# Altium schematic sheet 08. MT7688AN DDR2.SchDoc
size A2; DocumentNumber: 8; SheetNumber: 8; SheetTotal: 12
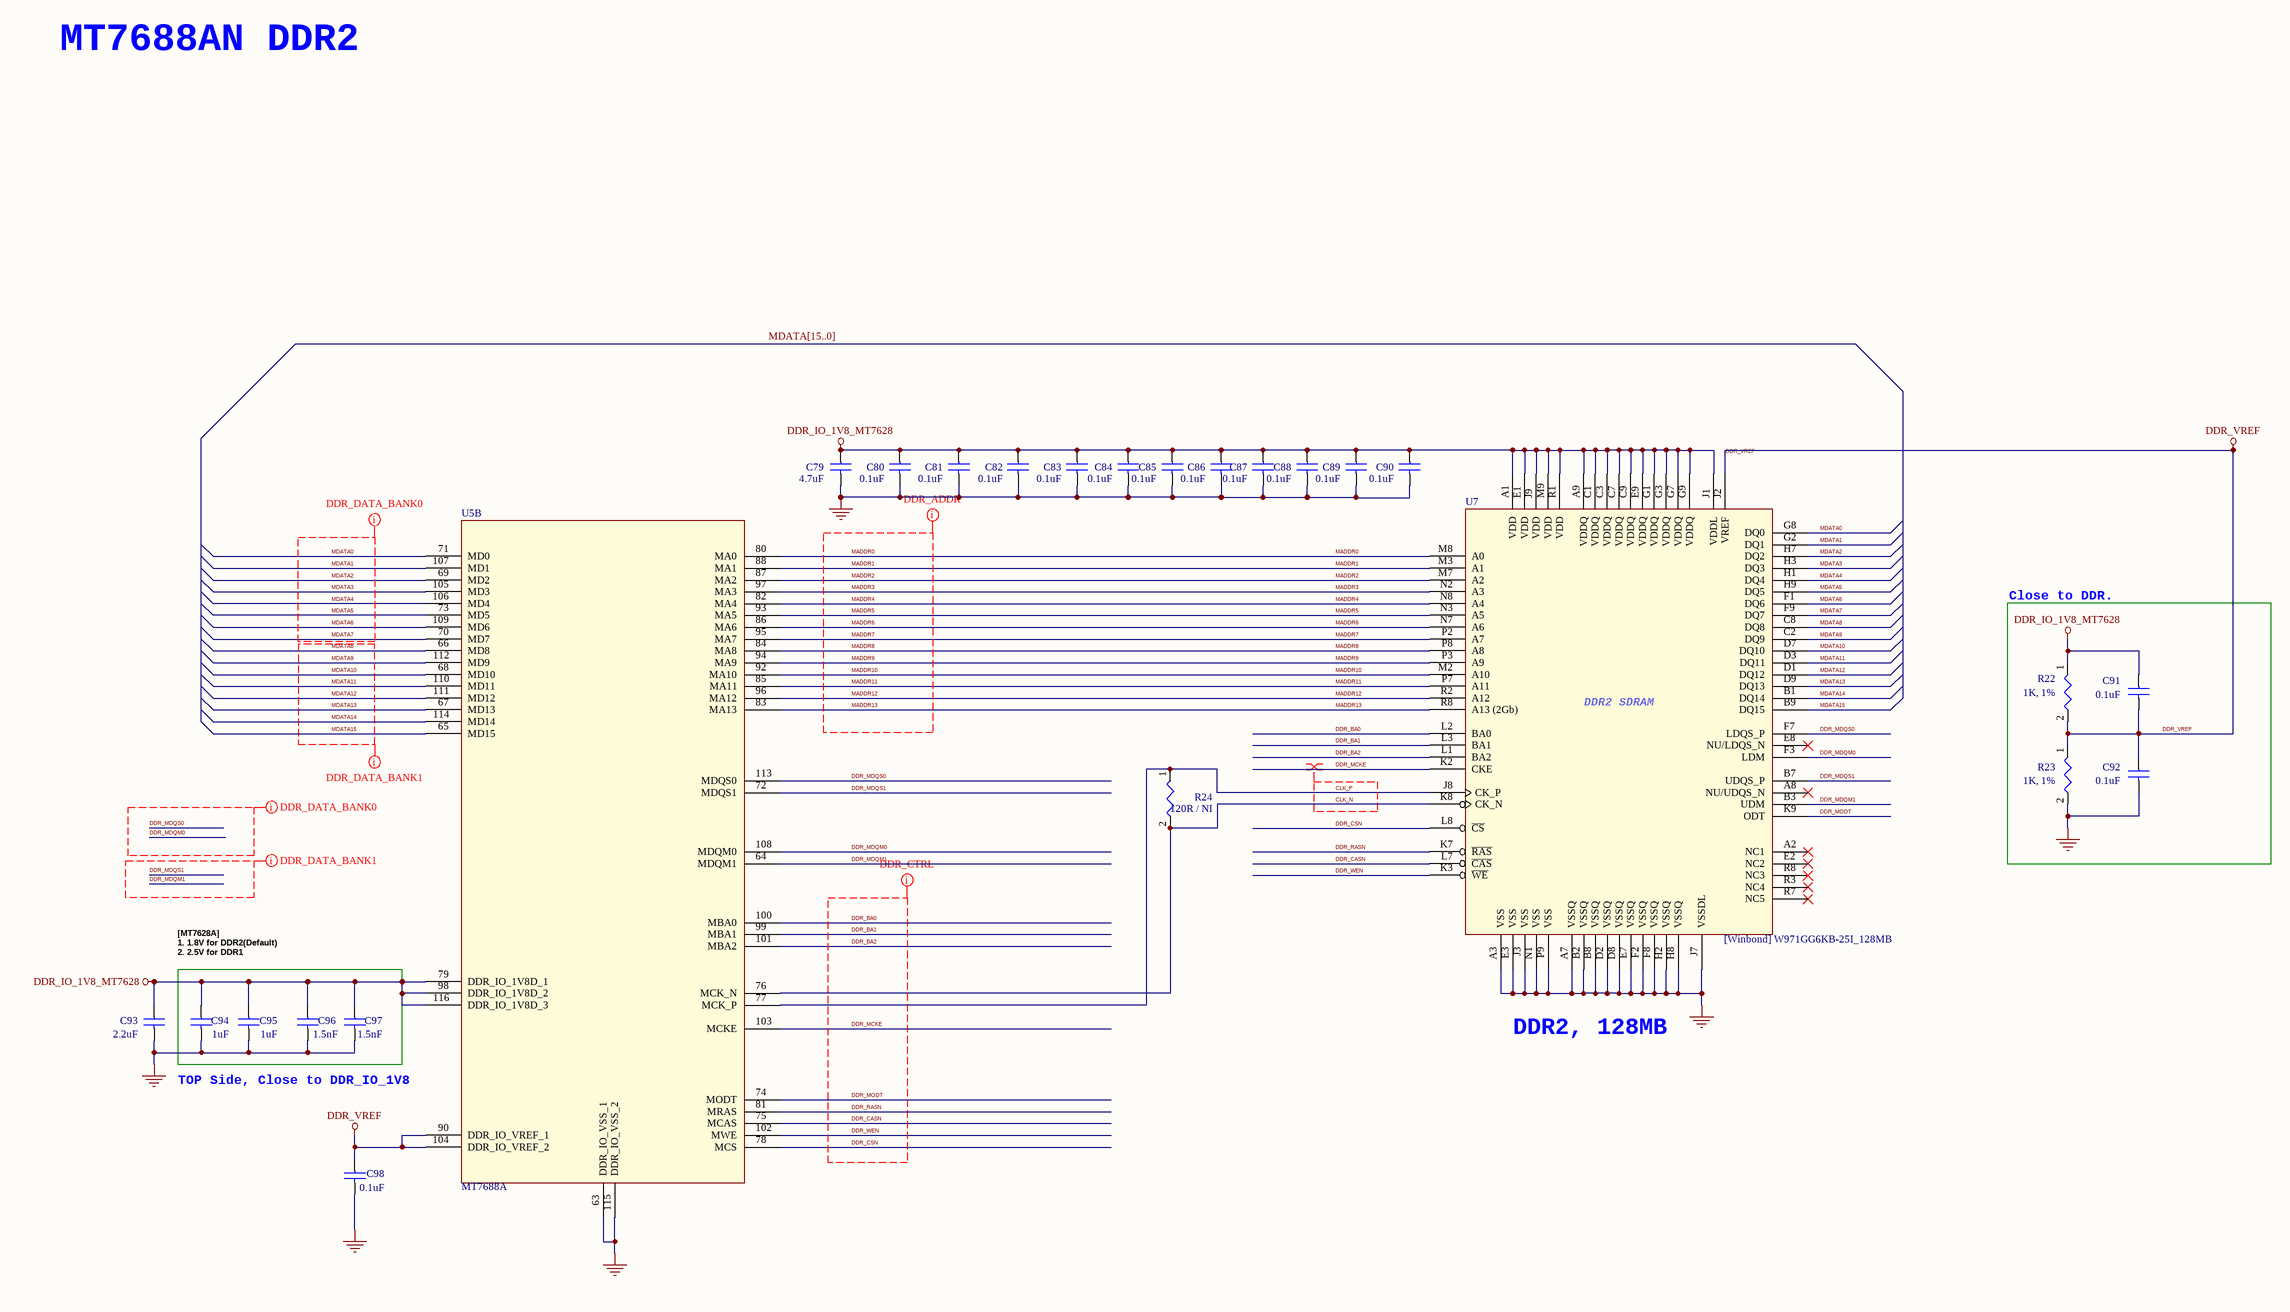
[diagram p0: 08. MT7688AN DDR2.SchDoc]

## Parts
C79  4.7uF  [CAPC1608X90X35NL10T15]
C80  0.1uF  [CAPC1005X60X30NL05T10]
C81  0.1uF  [CAPC1005X60X30NL05T10]
C82  0.1uF  [CAPC1005X60X30NL05T10]
C83  0.1uF  [CAPC1005X60X30NL05T10]
C84  0.1uF  [CAPC1005X60X30NL05T10]
C85  0.1uF  [CAPC1005X60X30NL05T10]
C86  0.1uF  [CAPC1005X60X30NL05T10]
C87  0.1uF  [CAPC1005X60X30NL05T10]
C88  0.1uF  [CAPC1005X60X30NL05T10]
C89  0.1uF  [CAPC1005X60X30NL05T10]
C90  0.1uF  [CAPC1005X60X30NL05T10]
C91  0.1uF  [CAPC1005X60X30NL05T10]
C92  0.1uF  [CAPC1005X60X30NL05T10]
C93  2.2uF  [CAPC1608X90X35NL10T15]
C94  1uF  [CAPC1608X90X35NL10T15]
C95  1uF  [CAPC1608X90X35NL10T15]
C96  1.5nF  [CAPC1005X60X30NL05T10]
C97  1.5nF  [CAPC1005X60X30NL05T10]
C98  0.1uF  [CAPC1005X60X30NL05T10]
R22  1K, 1%  [RESC1005X35X25NL10T10]
R23  1K, 1%  [RESC1005X35X25NL10T10]
R24  120R / NI  [RLC 0201 M35]
U5  MT7688A  [MT7628AN$2F$DRQFN156$2F$SMD$2F$P0.5$2F$12X12]  (part B of 6)
U7  [Winbond] W971GG6KB-25I_128MB  [BGA84C80P9X15X12X8]

## Blocks framed on the sheet
Close to DDR.: C91 C92 R22 R23

## Nets
DDR_IO_1V8_MT7628: C79.1 C80.1 C81.1 C82.1 C83.1 C84.1 C85.1 C86.1 C87.1 C88.1 C89.1 C90.1 C91.1 C93.1 C94.1 C95.1 C96.1 C97.1 R22.1 U5.79(DDR_IO_1V8D_1) U5.98(DDR_IO_1V8D_2) U5.116(DDR_IO_1V8D_3) U7.A1(VDD) U7.A9(VDDQ) U7.C1(VDDQ) U7.C3(VDDQ) U7.C7(VDDQ) U7.C9(VDDQ) U7.E1(VDD) U7.E9(VDDQ) U7.G1(VDDQ) U7.G3(VDDQ) U7.G7(VDDQ) U7.G9(VDDQ) U7.J1(VDDL) U7.J9(VDD) U7.M9(VDD) U7.R1(VDD)
DDR_VREF: C91.2 C92.1 C98.1 R22.2 R23.1 U5.90(DDR_IO_VREF_1) U5.104(DDR_IO_VREF_2) U7.J2(VREF)
GND: C79.2 C80.2 C81.2 C82.2 C83.2 C84.2 C85.2 C86.2 C87.2 C88.2 C89.2 C90.2 C92.2 C93.2 C94.2 C95.2 C96.2 C97.2 C98.2 R23.2 U5.63(DDR_IO_VSS_1) U5.115(DDR_IO_VSS_2) U7.A3(VSS) U7.A7(VSSQ) U7.B2(VSSQ) U7.B8(VSSQ) U7.D2(VSSQ) U7.D8(VSSQ) U7.E3(VSS) U7.E7(VSSQ) U7.F2(VSSQ) U7.F8(VSSQ) U7.H2(VSSQ) U7.H8(VSSQ) U7.J3(VSS) U7.J7(VSSDL) U7.N1(VSS) U7.P9(VSS)
CLK_N: R24.2 U5.76(MCK_N) U7.K8(CK_N)
CLK_P: R24.1 U5.77(MCK_P) U7.J8(CK_P)
DDR_BA0: U5.100(MBA0) U7.L2(BA0)
DDR_BA1: U5.99(MBA1) U7.L3(BA1)
DDR_BA2: U5.101(MBA2) U7.L1(BA2)
DDR_CASN: U5.75(MCAS) U7.L7(~{CAS})
DDR_CSN: U5.78(MCS) U7.L8(~{CS})
DDR_MCKE: U5.103(MCKE) U7.K2(CKE)
DDR_MDQM0: U5.108(MDQM0) U7.F3(LDM)
DDR_MDQM1: U5.64(MDQM1) U7.B3(UDM)
DDR_MDQS0: U5.113(MDQS0) U7.F7(LDQS_P)
DDR_MDQS1: U5.72(MDQS1) U7.B7(UDQS_P)
DDR_MODT: U5.74(MODT) U7.K9(ODT)
DDR_RASN: U5.81(MRAS) U7.K7(~{RAS})
DDR_WEN: U5.102(MWE) U7.K3(~{WE})
MADDR0: U5.80(MA0) U7.M8(A0)
MADDR1: U5.88(MA1) U7.M3(A1)
MADDR2: U5.87(MA2) U7.M7(A2)
MADDR3: U5.97(MA3) U7.N2(A3)
MADDR4: U5.82(MA4) U7.N8(A4)
MADDR5: U5.93(MA5) U7.N3(A5)
MADDR6: U5.86(MA6) U7.N7(A6)
MADDR7: U5.95(MA7) U7.P2(A7)
MADDR8: U5.84(MA8) U7.P8(A8)
MADDR9: U5.94(MA9) U7.P3(A9)
MADDR10: U5.92(MA10) U7.M2(A10)
MADDR11: U5.85(MA11) U7.P7(A11)
MADDR12: U5.96(MA12) U7.R2(A12)
MADDR13: U5.83(MA13) U7.R8(A13_(2Gb))
MDATA0: U5.71(MD0) U7.G8(DQ0)
MDATA1: U5.107(MD1) U7.G2(DQ1)
MDATA2: U5.69(MD2) U7.H7(DQ2)
MDATA3: U5.105(MD3) U7.H3(DQ3)
MDATA4: U5.106(MD4) U7.H1(DQ4)
MDATA5: U5.73(MD5) U7.H9(DQ5)
MDATA6: U5.109(MD6) U7.F1(DQ6)
MDATA7: U5.70(MD7) U7.F9(DQ7)
MDATA8: U5.66(MD8) U7.C8(DQ8)
MDATA9: U5.112(MD9) U7.C2(DQ9)
MDATA10: U5.68(MD10) U7.D7(DQ10)
MDATA11: U5.110(MD11) U7.D3(DQ11)
MDATA12: U5.111(MD12) U7.D1(DQ12)
MDATA13: U5.67(MD13) U7.D9(DQ13)
MDATA14: U5.114(MD14) U7.B1(DQ14)
MDATA15: U5.65(MD15) U7.B9(DQ15)

Not connected (* = marked no-connect by the designer): U7 A2(NC1)* A8(NU/UDQS_N)* E2(NC2)* E8(NU/LDQS_N)* R3(NC4)* R7(NC5)*

## Buses and harness runs
bus MDATA[15..0]

## Layout directives
net class DDR_DATA_BANK1; rule Matched Net Lengths [Tolerance = 20mil]: DDR_MDQM1, DDR_MDQS1, MDATA8, MDATA9, MDATA10, MDATA11, MDATA12, MDATA13, MDATA14, MDATA15
net class DDR_DATA_BANK0; rule Matched Net Lengths [Tolerance = 20mil]: DDR_MDQM0, DDR_MDQS0, MDATA0, MDATA1, MDATA2, MDATA3, MDATA4, MDATA5, MDATA6, MDATA7
net class DDR2_CLK; rule Matched Net Lengths [Tolerance = 20mil]: CLK_N, CLK_P
rule Matched Net Lengths [Tolerance = 50mil]; net class DDR2_ADDR_CTRL: DDR_BA0, DDR_BA1, DDR_BA2, DDR_CASN, DDR_CSN, DDR_MCKE, DDR_MODT, DDR_RASN, DDR_WEN, MADDR0, MADDR1, MADDR2, MADDR3, MADDR4, MADDR5, MADDR6, MADDR7, MADDR8, MADDR9, MADDR10, MADDR11, MADDR12, MADDR13

## Notes on the sheet
- MT7688AN DDR2
- [MT7628A]
  1. 1.8V for DDR2(Default)
  2. 2.5V for DDR1
- DDR2, 128MB
- TOP Side, Close to DDR_IO_1V8
- Title
- Size:
- Date:
- Design by:
- A4
- Number:
- Time:
- Check by:
- Revision:
- Sheet
- of
- N.S.T
- https://github.com/tung080827
- (in symbol W971GG6KB-25I) DDR2 SDRAM

## Library data of the parts
C79-C98 = CAP NP
R22-R24 = RES/0402_3
U5 = MT7620N-n_26
U7 = W971GG6KB-25I: DDR2, 128MB